# EAGLE design Daughter2 (EAGLE 9.6.2)
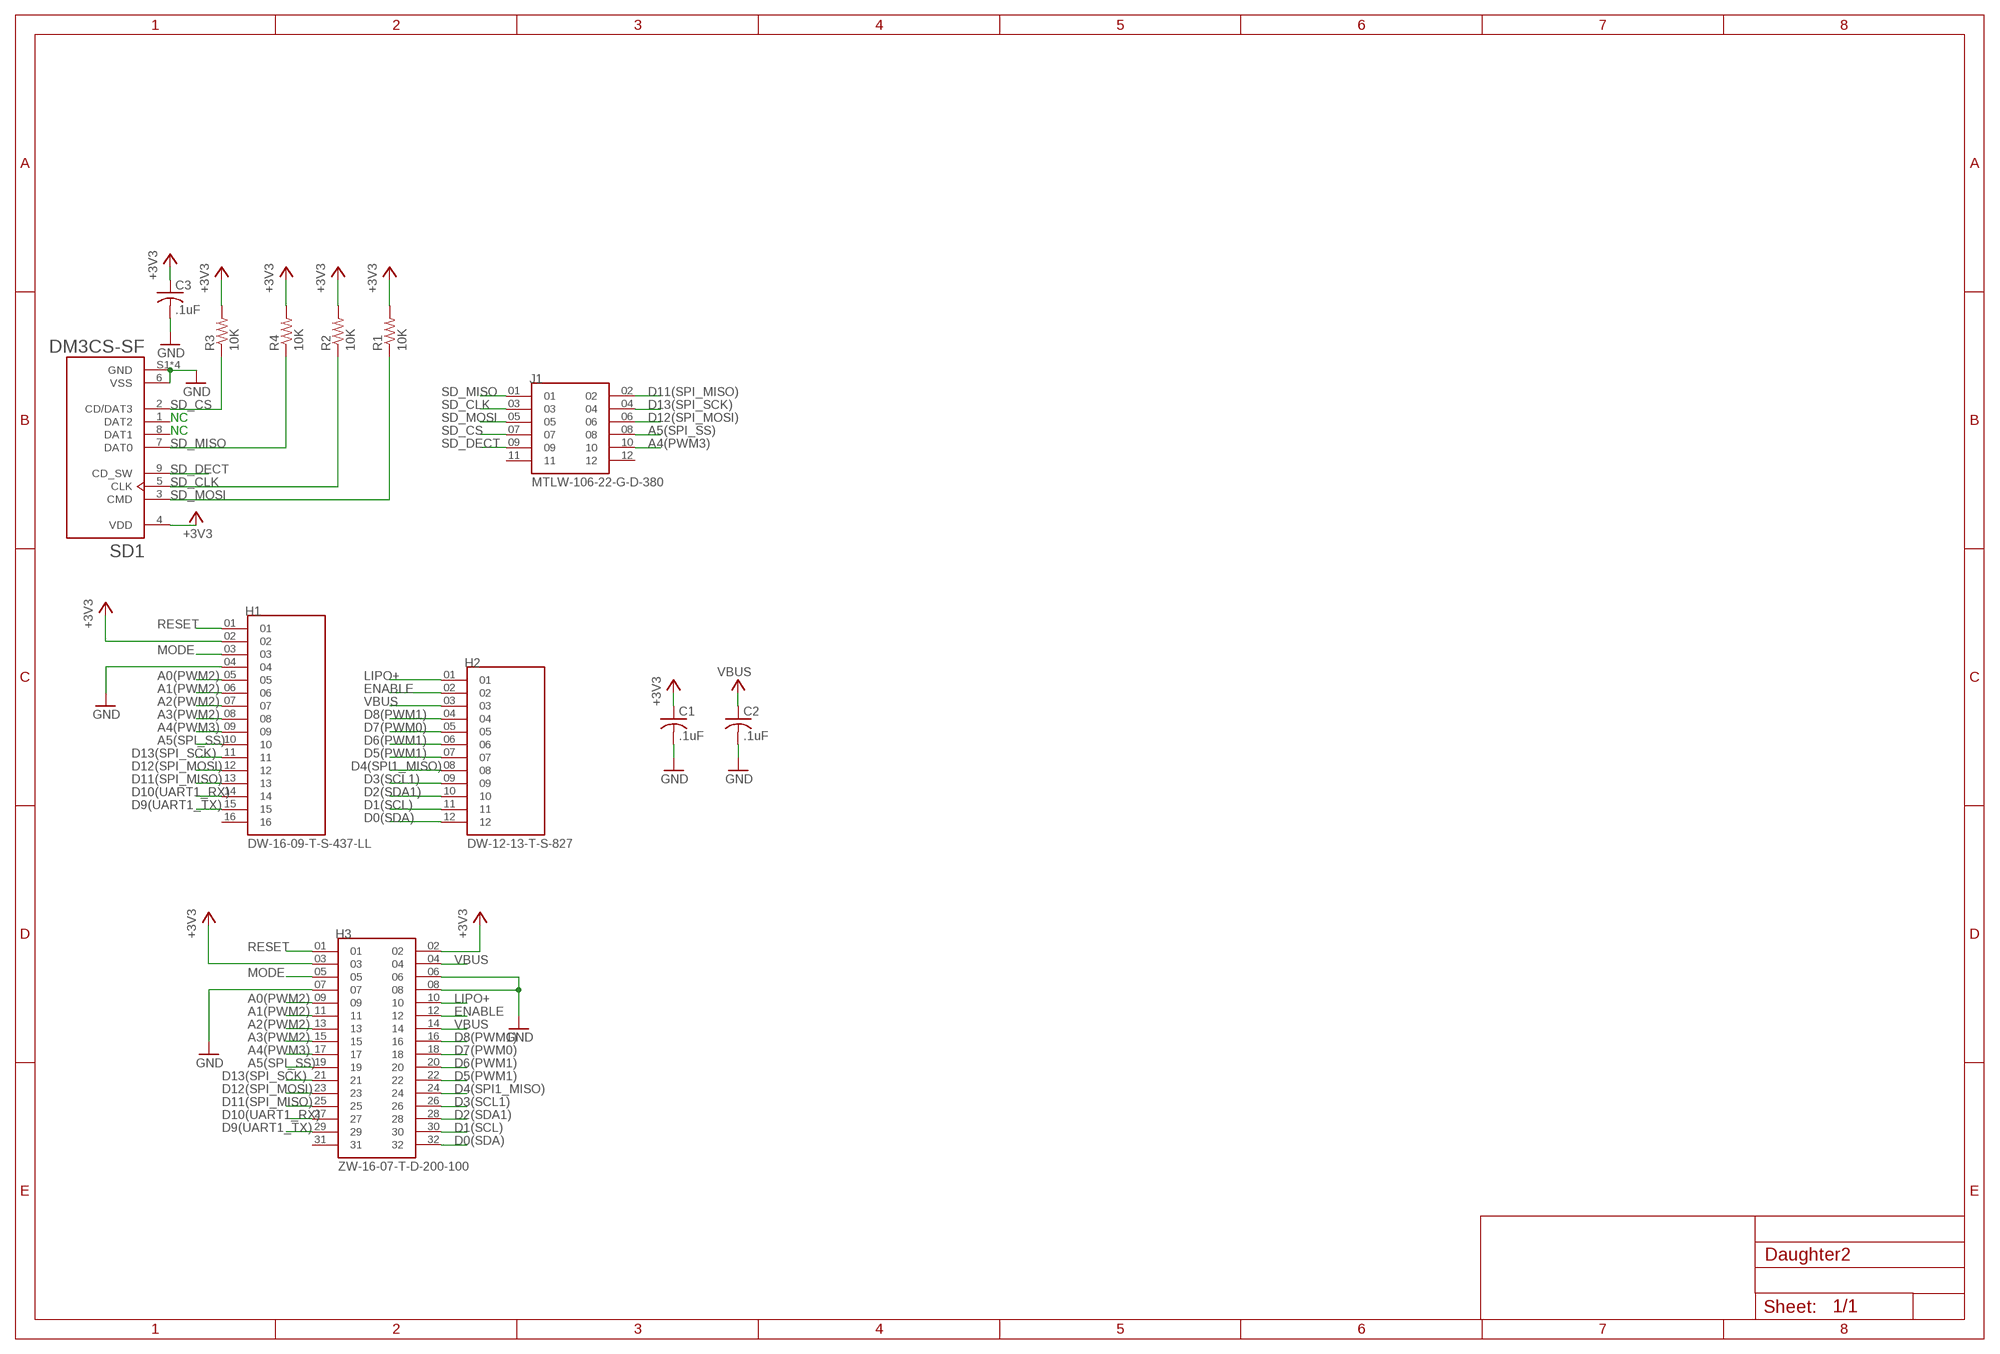
[diagram p0: schematic, sheet 1]

## Parts
C1  .1uF  C-USC0805  [C0805]
C2  .1uF  C-USC0805  [C0805]
C3  .1uF  C-USC0805  [C0805]
H1  DW-16-09-T-S-437-LL  [SAMTEC_DW-16-09-T-S-437-LL]
H2  DW-12-13-T-S-827  [SAMTEC_DW-12-13-T-S-827]
H3  ZW-16-07-T-D-200-100  [SAMTEC_ZW-16-07-T-D-200-100]
J1  MTLW-106-22-G-D-380  [SAMTEC_MTLW-106-22-G-D-380]
R1  10K  R-US_R0805  [R0805]
R2  10K  R-US_R0805  [R0805]
R3  10K  R-US_R0805  [R0805]
R4  10K  R-US_R0805  [R0805]
SD1  DM3CS-SF  [HRS_DM3CS-SF]

## Nets
+3V3: C1.1 C3.1 H1.02 H3.02 H3.03 R1.2 R2.2 R3.2 R4.2 SD1.4(VDD)
A0(PWM2): H1.05 H3.09
A1(PWM2): H1.06 H3.11
A2(PWM2): H1.07 H3.13
A3(PWM2): H1.08 H3.15
A4(PWM3): H1.09 H3.17 J1.10
A5(SPI_SS): H1.10 H3.19 J1.08
D0(SDA): H2.12 H3.32
D1(SCL): H2.11 H3.30
D2(SDA1): H2.10 H3.28
D3(SCL1): H2.09 H3.26
D4(SPI1_MISO): H2.08 H3.24
D5(PWM1): H2.07 H3.22
D6(PWM1): H2.06 H3.20
D7(PWM0): H2.05 H3.18
D8(PWM1): H2.04 H3.16
D9(UART1_TX): H1.15 H3.29
D10(UART1_RX): H1.14 H3.27
D11(SPI_MISO): H1.13 H3.25 J1.02
D12(SPI_MOSI): H1.12 H3.23 J1.06
D13(SPI_SCK): H1.11 H3.21 J1.04
ENABLE: H2.02 H3.12
GND: C1.2 C2.2 C3.2 H1.04 H3.06 H3.07 H3.08 SD1.6(VSS) SD1.S1(GND) SD1.S2(GND) SD1.S3(GND) SD1.S5(GND)
LIPO+: H2.01 H3.10
MODE: H1.03 H3.05
RESET: H1.01 H3.01
SD_CLK: J1.03 R2.1 SD1.5(CLK)
SD_CS: J1.07 R3.1 SD1.2(CD/DAT3)
SD_DECT: J1.09 SD1.9(CD_SW)
SD_MISO: J1.01 R4.1 SD1.7(DAT0)
SD_MOSI: J1.05 R1.1 SD1.3(CMD)
VBUS: C2.1 H2.03 H3.04 H3.14 ; supply symbol labelled VCC
Unconnected: H1.16 H3.31 J1.11 J1.12 SD1.1(DAT2) SD1.8(DAT1)

## Notes on the sheet
- NC
- NC

## Library data of the parts
C1-C3 = rcl:C-US: CAPACITOR, American symbol; SPICEPREFIX: C
H1 = DW-16-09-T-S-437-LL:DW-16-09-T-S-437-LL: Check availability <https://pricing.snapeda.com/parts/DW-16-09-T-S-437-LL/Samtec/view-part?ref=eda>; AVAILABILITY: In Stock; DESCRIPTION: 16 Position Header Spacer Connector 0.100 (2.54mm) Tin Through Hole; MF: Samtec; MP: DW-16-09-T-S-437-LL; PACKAGE: None; PRICE: None; PURCHASE-URL: https://pricing.snapeda.com/search/part/DW-16-09-T-S-437-LL/?ref=eda
H2 = DW-12-13-T-S-827:DW-12-13-T-S-827: Check availability <https://pricing.snapeda.com/parts/DW-12-13-T-S-827/Samtec%20Inc./view-part?ref=eda>; AVAILABILITY: In Stock; DESCRIPTION: 12 Position Header Spacer Connector 0.100 (2.54mm) Tin Through Hole; MF: Samtec Inc.; MP: DW-12-13-T-S-827; PACKAGE: None; PRICE: None; PURCHASE-URL: https://pricing.snapeda.com/search/part/DW-12-13-T-S-827/?ref=eda
H3 = ZW-16-07-T-D-200-100:ZW-16-07-T-D-200-100: Check availability <https://pricing.snapeda.com/parts/ZW-16-07-T-D-200-100/Samtec%20Inc./view-part?ref=eda>; AVAILABILITY: In Stock; DESCRIPTION: 32 Position Header Spacer Connector 0.100 (2.54mm) Tin Through Hole; MF: Samtec Inc.; MP: ZW-16-07-T-D-200-100; PACKAGE: None; PRICE: None; PURCHASE-URL: https://pricing.snapeda.com/search/part/ZW-16-07-T-D-200-100/?ref=eda
J1 = MTLW-106-22-G-D-380:MTLW-106-22-G-D-380: Check availability <https://pricing.snapeda.com/parts/MTLW-106-22-G-D-380/Samtec/view-part?ref=eda>; AVAILABILITY: In Stock; DESCRIPTION: CONN HEADER VERT 12POS 2.54MM; MF: Samtec; MP: MTLW-106-22-G-D-380; PACKAGE: None; PRICE: None; PURCHASE-URL: https://pricing.snapeda.com/search/part/MTLW-106-22-G-D-380/?ref=eda
R1-R4 = rcl:R-US_: RESISTOR, American symbol; SPICEPREFIX: R
SD1 = DM3CS-SF:DM3CS-SF: CONN MICRO SD CARD HINGED TYPE Check availability <https://pricing.snapeda.com/parts/DM3CS-SF/Hirose/view-part?ref=eda>; AVAILABILITY: In Stock; DESCRIPTION: 10 (8 + 2) Position Card Connector Secure Digital - microSD™ Surface Mount, Right Angle Gold; MF: Hirose; MP: DM3CS-SF; PACKAGE: None; PRICE: None; PURCHASE-URL: https://pricing.snapeda.com/search/part/DM3CS-SF/?ref=eda

## Net classes
0 default: width 0.305 mm, drill 0.508 mm, clearance 0.254 mm

## Board
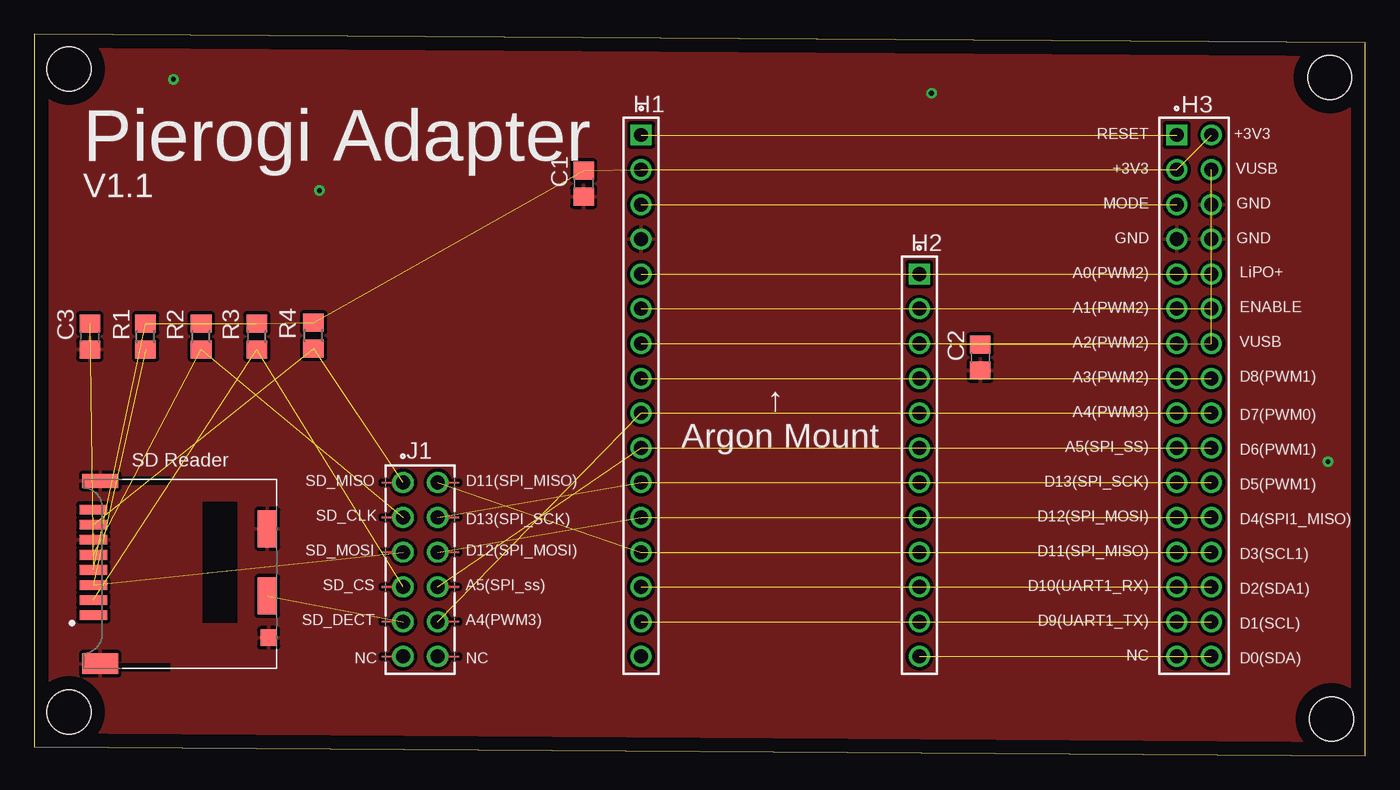
[diagram p1: board, top side]
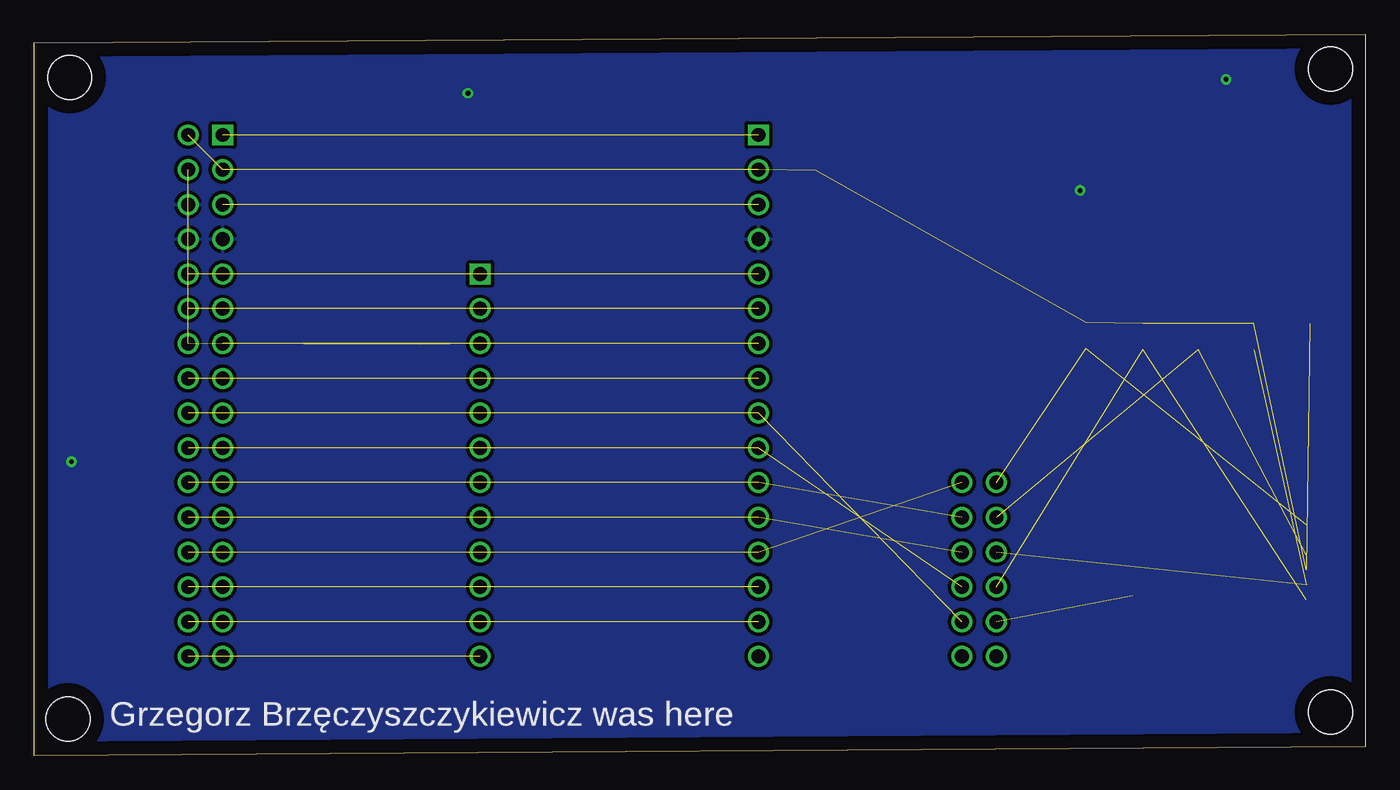
[diagram p2: board, bottom side, seen from below]

Size 97.21 x 52.7 mm. Coordinates in mm from the lower left corner, seen from the top.
Outline: 0,0.64 97.21,0 97.21,52.06 0,52.7 0,0.64
Copper layers (1*16): Top 0.035mm / dielectric 1.5mm / Bottom 0.035mm
Design rules "default": minimum track width 6mil, minimum drill 0.35mm, track to track 6mil, track to pad 6mil, pad to pad 6mil, via to via 6mil, smd to smd 6mil, copper to edge 40mil, drill to drill 6mil, minimum pad ring 10mil, minimum via ring 8mil, stop-mask expansion 4mil, vias tented up to drill 0mil, thermal gap 10mil
Holes 3.2 mm at 2.54,50.17 94.61,49.53 2.54,3.18 94.74,2.67

### Footprints (pad centres in the part's own frame; a part is rotated, then mirrored left to right if it is on the bottom)
C0805 = smd 1.3 x 1.5: 1 -0.95,0; 2 0.95,0
SAMTEC_DW-16-09-T-S-437-LL = drill 1.02 pad 1.37 square: 01 0,0 | drill 1.02 pad 1.37: 02 2.54,0; 03 5.08,0; 04 7.62,0; 05 10.16,0; 06 12.7,0; 07 15.24,0; 08 17.78,0; 09 20.32,0; 10 22.86,0; 11 25.4,0; 12 27.94,0; 13 30.48,0; 14 33.02,0; 15 35.56,0; 16 38.1,0
SAMTEC_DW-12-13-T-S-827 = drill 1.02 pad 1.37 square: 01 0,0 | drill 1.02 pad 1.37: 02 2.54,0; 03 5.08,0; 04 7.62,0; 05 10.16,0; 06 12.7,0; 07 15.24,0; 08 17.78,0; 09 20.32,0; 10 22.86,0; 11 25.4,0; 12 27.94,0
SAMTEC_ZW-16-07-T-D-200-100 = drill 1.02 pad 1.37 square: 01 0,0 | drill 1.02 pad 1.37: 02 0,2.54; 03 2.54,0; 04 2.54,2.54; 05 5.08,0; 06 5.08,2.54; 07 7.62,0; 08 7.62,2.54; 09 10.16,0; 10 10.16,2.54; 11 12.7,0; 12 12.7,2.54; 13 15.24,0; 14 15.24,2.54; 15 17.78,0; 16 17.78,2.54; 17 20.32,0; 18 20.32,2.54; 19 22.86,0; 20 22.86,2.54; 21 25.4,0; 22 25.4,2.54; 23 27.94,0; 24 27.94,2.54; 25 30.48,0; 26 30.48,2.54; 27 33.02,0; 28 33.02,2.54; 29 35.56,0; 30 35.56,2.54; 31 38.1,0; 32 38.1,2.54
SAMTEC_MTLW-106-22-G-D-380 = drill 1.02 pad 1.52: 01 -6.35,-1.27; 02 -6.35,1.27; 03 -3.81,-1.27; 04 -3.81,1.27; 05 -1.27,-1.27; 06 -1.27,1.27; 07 1.27,-1.27; 08 1.27,1.27; 09 3.81,-1.27; 10 3.81,1.27; 11 6.35,-1.27; 12 6.35,1.27
R0805 = smd 1.3 x 1.5: 1 -0.95,0; 2 0.95,0
HRS_DM3CS-SF = smd 0.7 x 2: 1 3.2,-6.35; 2 2.1,-6.35; 3 1,-6.35; 4 -0.1,-6.35; 5 -1.2,-6.35; 6 -2.3,-6.35; 7 -3.4,-6.35; 8 -4.5,-6.35 | smd 2.7 x 1.4: 9 1.8,6.35; S3 -3.1,6.35 | smd 1 x 2.6: S1 -6.6,-5.85 | smd 1.5 x 2.6: S2 6.75,-5.85 | smd 1.2 x 1.2: S5 4.85,6.45

### Placement (x,y rotation side)
C1  40.13,41.78 270 top
C2  69.09,29.08 270 top
C3  4.06,30.61 270 top
H1  44.32,45.34 270 top
H2  64.64,35.18 270 top
H3  83.44,45.34 270 top
J1  28.19,13.59 270 top
R1  8.13,30.61 90 top
R2  12.19,30.61 90 top
R3  16.26,30.61 90 top
R4  20.4,30.68 90 top
SD1  10.67,13.46 270 top

### Tracks (layer width: path | path; a pad name or v marks a point on that pad's centre or on a via)
+3V3  (9 unrouted)
A0(PWM2)  (1 unrouted)
A1(PWM2)  (1 unrouted)
A2(PWM2)  (1 unrouted)
A3(PWM2)  (1 unrouted)
A4(PWM3)  (2 unrouted)
A5(SPI_SS)  (2 unrouted)
D0(SDA)  (1 unrouted)
D1(SCL)  (1 unrouted)
D2(SDA1)  (1 unrouted)
D3(SCL1)  (1 unrouted)
D4(SPI1_MISO)  (1 unrouted)
D5(PWM1)  (1 unrouted)
D6(PWM1)  (1 unrouted)
D7(PWM0)  (1 unrouted)
D8(PWM1)  (1 unrouted)
D9(UART1_TX)  (1 unrouted)
D10(UART1_RX)  (1 unrouted)
D11(SPI_MISO)  (2 unrouted)
D12(SPI_MOSI)  (2 unrouted)
D13(SPI_SCK)  (2 unrouted)
ENABLE  (1 unrouted)
GND  (via drill 0.35)
  other vias: 10.16,49.4 20.83,41.28 65.53,48.39 94.49,21.46
  pour Top: -1.27,53.97 100.08,53.97 100.08,-0.63 -1.27,-0.63
  pour Bottom: -2.54,55.25 101.85,55.25 101.85,-1.9 -2.54,-1.9
LIPO+  (1 unrouted)
MODE  (1 unrouted)
RESET  (1 unrouted)
SD_CLK  (2 unrouted)
SD_CS  (2 unrouted)
SD_DECT  (1 unrouted)
SD_MISO  (2 unrouted)
SD_MOSI  (2 unrouted)
VBUS  (3 unrouted)

### Text on the board
tNames: RESET | +3V3 | +3V3 | VUSB | V1.1 | MODE | GND | Pierogi Adapter | GND | GND | A0(PWM2) | LiPO+ | A1(PWM2) | ENABLE | A2(PWM2) | VUSB | A3(PWM2) | D8(PWM1) | A4(PWM3) | D7(PWM0) | A5(SPI_SS) | ↑ / Argon Mount | D6(PWM1) | SD Reader | SD_MISO | D11(SPI_MISO) | D13(SPI_SCK) | D5(PWM1) | D12(SPI_MOSI) | SD_CLK | D13(SPI_SCK) | D4(SPI1_MISO) | D11(SPI_MISO) | SD_MOSI | D12(SPI_MOSI) | D3(SCL1) | D10(UART1_RX) | SD_CS | A5(SPI_ss) | D2(SDA1) | D9(UART1_TX) | SD_DECT | A4(PWM3) | D1(SCL) | NC | NC | NC | D0(SDA)
bNames: Grzegorz Brzęczyszczykiewicz was here